# EAGLE design CAN_node_rpm_nof2v (EAGLE 7.2.0)
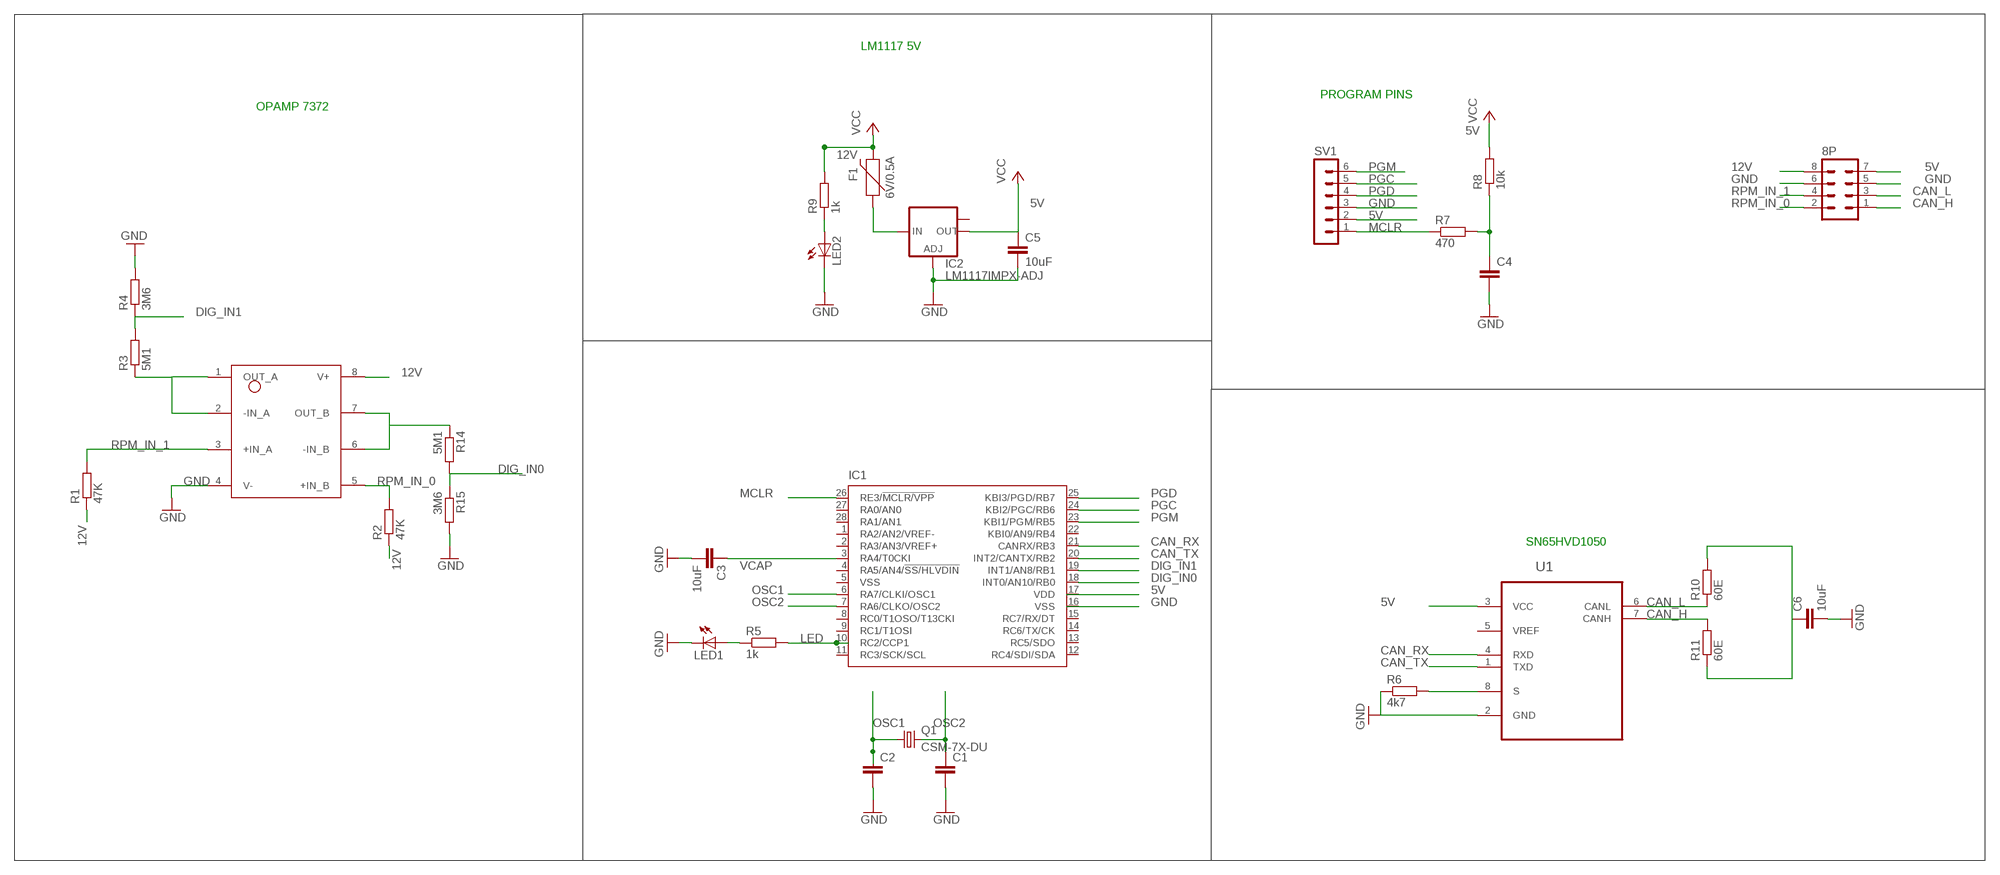
[diagram p0: schematic, sheet 1]

## Parts
8P  MA04-2  [MA04-2]
C1  C-EUC0805  [C0805]
C2  C-EUC0805  [C0805]
C3  10uF  C-EUC0805  [C0805]
C4  C-EUC0805  [C0805]
C5  10uF  C-EUC0805  [C0805]
C6  10uF  C-EUC0805  [C0805]
F1  6V/0.5A  PPTC_HALF-AMP  [1206]
IC1  MICROCHIP_PIC18F2580-I/ML  [MICROCHIP_QFN28-ML_6X6MM]
IC2  LM1117IMPX-ADJ  [SOT223]
LED1  LED_LEDCHIPLED_1206  [LED_CHIPLED_1206]
LED2  LED_LEDCHIPLED_1206  [LED_CHIPLED_1206]
LM1  7372  [7372]
Q1  CSM-7X-DU  [CSM-7X-DU]
R1  47K  R-EU_R0805  [R0805]
R2  47K  R-EU_R0805  [R0805]
R3  5M1  R-EU_R0805  [R0805]
R4  3M6  R-EU_R0805  [R0805]
R5  1k  R-EU_R0805  [R0805]
R6  4k7  R-EU_R0805  [R0805]
R7  470  R-EU_R0805  [R0805]
R8  10k  R-EU_R0805  [R0805]
R9  1k  R-EU_R0805  [R0805]
R10  60E  R-EU_R0805  [R0805]
R11  60E  R-EU_R0805  [R0805]
R14  5M1  R-EU_R0805  [R0805]
R15  3M6  R-EU_R0805  [R0805]
SV1  MA06-1  [MA06-1]
U1  TEXAS-INSTRUMENTS_BY_ELEMENT14_BATCH_1_SN65HVD1050D  [TEXAS-INSTRUMENTS_BY_ELEMENT14_BATCH_1_SOIC127P600X175-8N]

## Nets
5V: 8P.7 C5.1 IC1.17(VDD) IC2.2(OUT) R8.2 SV1.2 U1.3(VCC) ; supply symbol labelled VCC
12V: 8P.8 F1.2 LM1.8(V+) R1.1 R2.1 R9.2 ; supply symbol labelled VCC
CAN_H: 8P.1 R11.2 U1.7(CANH)
CAN_L: 8P.3 R10.1 U1.6(CANL)
CAN_RX: IC1.21(CANRX/RB3) U1.4(RXD)
CAN_TX: IC1.20(INT2/CANTX/RB2) U1.1(TXD)
DIG_IN0: IC1.18(INT0/AN10/RB0) R14.2 R15.1
DIG_IN1: IC1.19(INT1/AN8/RB1) R3.2 R4.1
GND: 8P.5 8P.6 C1.2 C2.2 C3.2 C4.2 C5.2 C6.2 IC1.16(VSS) IC2.1(ADJ) LED1.C LED2.C LM1.4(V-) R4.2 R6.1 R15.2 SV1.3 U1.2(GND)
LED: IC1.10(RC2/CCP1) R5.2
MCLR: IC1.26(RE3/!MCLR/VPP) R7.1 SV1.1
N$1: LED1.A R5.1
N$2: R6.2 U1.8(S)
N$3: C4.1 R7.2 R8.1
N$4: F1.1 IC2.3(IN)
N$5: LED2.A R9.1
N$7: C6.1 R10.2 R11.1
N$8: LM1.1(OUT_A) LM1.2(-IN_A) R3.1
N$10: LM1.6(-IN_B) LM1.7(OUT_B) R14.1
OSC1: C2.1 IC1.6(RA7/CLKI/OSC1) Q1.1
OSC2: C1.1 IC1.7(RA6/CLKO/OSC2) Q1.2
PGC: IC1.24(KBI2/PGC/RB6) SV1.5
PGD: IC1.25(KBI3/PGD/RB7) SV1.4
PGM: IC1.23(KBI1/PGM/RB5) SV1.6
RPM_IN_0: 8P.2 LM1.5(+IN_B) R2.2
RPM_IN_1: 8P.4 LM1.3(+IN_A) R1.2
VCAP: C3.1 IC1.3(RA4/T0CKI)
Unconnected: IC1.1(RA2/AN2/VREF-) IC1.2(RA3/AN3/VREF+) IC1.4(RA5/AN4/!SS/HLVDIN) IC1.8(RC0/T1OSO/T13CKI) IC1.9(RC1/T1OSI) IC1.11(RC3/SCK/SCL) IC1.12(RC4/SDI/SDA) IC1.13(RC5/SDO) IC1.14(RC6/TX/CK) IC1.15(RC7/RX/DT) IC1.22(KBI0/AN9/RB4) IC1.27(RA0/AN0) IC1.28(RA1/AN1) IC2.TAB(OUT1) U1.5(VREF)

## Notes on the sheet
- LM1117 5V
- PROGRAM PINS
- OPAMP 7372
- SN65HVD1050

## Power pins joined to a net without a drawn wire
VSS: IC1.5(VSS)

## Library data of the parts
8P = con-lstb:MA04-2: PIN HEADER; OC_FARNELL: unknown; OC_NEWARK: unknown
C1 C2 C4 C5 = rcl:C-EU: CAPACITOR, European symbol
C3 C6 = resistor:C-EU: CAPACITOR, European symbol
F1 = sparkfun_fuses:PPTC: Resettable Fuse PPTC Resettable Fuse. Really a sort of resistor with a polymeric positive temperature coefficient whose resistance increases dramatically with an increase in temperature. When heated by the power passing through the resistance rises causing the current to be limited, protecting the circuit. This is achieved by the transition of the polymer from a crystalline to an amorphous state where the conductive carbon separates breaking the conductive pathways found in the cool crystalline structure. When a PPTC cools back down it resumes conducting letting the circuit turn back on. SparkFun Products: SparkFun RedBoard - Programmed with Arduino <https://www.sparkfun.com/products/12757> Pro Micro - 5V/16MHz <https://www.sparkfun.com/products/12640> Arduino Pro 328 - 5V/16MHz <https://www.sparkfun.com/products/10915> MP3 Trigger <https://www.sparkfun.com/products/13720>; PROD_ID: RES-08585
IC1 = IITBRacing_CAN_node_Evo5:MICROCHIP_PIC18F2*80: 28-Pin Enhanced Flash Microcontrollers with ECAN(TM) Technology 10-Bit A/D and nanoWatt Technology Source: http://www.microchip.com .. 39637a.pdf; MF: MICROCHIP; MPN: PIC18F2580-I/ML; OC_FARNELL: 1556180; OC_NEWARK: 71J7242
IC2 = lm1117:LM1117IMPX-ADJ
LED1 LED2 = IITBRacing_CAN_node_Evo5:LED_LED: LED OSRAM: - CHIPLED LG R971, LG N971, LY N971, LG Q971, LY Q971, LO R971, LY R971 LH N974, LH R974 LS Q976, LO Q976, LY Q976 LO Q996 - Hyper CHIPLED LW Q18S LB Q993, LB Q99A, LB R99A - SideLED LS A670, LO A670, LY A670, LG A670, LP A670 LB A673, LV A673, LT A673, LW A673 LH A674 LY A675 LS A676, LA A676, LO A676, LY A676, LW A676 LS A679, LY A679, LG A679 - Hyper Micro SIDELED® LS Y876, LA Y876, LO Y876, LY Y876 LT Y87S - SmartLED LW L88C, LW L88S LB L89C, LB L89S, LG L890 LS L89K, LO L89K, LY L89K LS L896, LA L896, LO L896, LY L896 - TOPLED LS T670, LO T670, LY T670, LG T670, LP T670 LSG T670, LSP T670, LSY T670, LOP T670, LYG T670 LG T671, LOG T671, LSG T671 LB T673, LV T673, LT T673, LW T673 LH T674 LS T676, LA T676, LO T676, LY T676, LB T676, LH T676, LSB T676, LW T676 LB T67C, LV T67C, LT T67C, LS T67K, LO T67K, LY T67K, LW E67C LS E67B, LA E67B, LO E67B, LY E67B, LB E67C, LV E67C, LT E67C LW T67C LS T679, LY T679, LG T679 LS T770, LO T770, LY T770, LG T770, LP T770 LB T773, LV T773, LT T773, LW T773 LH T774 LS E675, LA E675, LY E675, LS T675 LS T776, LA T776, LO T776, LY T776, LB T776 LHGB T686 LT T68C, LB T68C - Hyper Mini TOPLED® LB M676 - Mini TOPLED Santana® LG M470 LS M47K, LO M47K, LY M47K Source: http://www.osram.convergy.de LUXEON: - LUMILED® LXK2-PW12-R00, LXK2-PW12-S00, LXK2-PW14-U00, LXK2-PW14-V00 LXK2-PM12-R00, LXK2-PM12-S00, LXK2-PM14-U00 LXK2-PE12-Q00, LXK2-PE12-R00, LXK2-PE12-S00, LXK2-PE14-T00, LXK2-PE14-U00 LXK2-PB12-K00, LXK2-PB12-L00, LXK2-PB12-M00, LXK2-PB14-N00, LXK2-PB14-P00, LXK2-PB14-Q00 LXK2-PR12-L00, LXK2-PR12-M00, LXK2-PR14-Q00, LXK2-PR14-R00 LXK2-PD12-Q00, LXK2-PD12-R00, LXK2-PD12-S00 LXK2-PH12-R00, LXK2-PH12-S00 LXK2-PL12-P00, LXK2-PL12-Q00, LXK2-PL12-R00 Source: www.luxeon.com KINGBRIGHT: KA-3528ASYC Source: www.kingbright.com
LM1 = 7372:7372
Q1 = crystal:CSM-7X-DU: SMD CRYSTAL Source: www.ecsxtal.com .. Crystal 3.6864MHz CSM_7X_DU.PDF; OC_FARNELL: unknown; OC_NEWARK: unknown
R1-R11 R14 R15 = resistor:R-EU_: RESISTOR, European symbol
SV1 = con-lstb:MA06-1: PIN HEADER; OC_FARNELL: unknown; OC_NEWARK: unknown
U1 = IITBRacing_CAN_node_Evo5:TEXAS-INSTRUMENTS_BY_ELEMENT14_BATCH_1_SN65HVD1050D: EMC OPTIMIZED CAN TRANSCEIVER; MPN: SN65HVD1050D; OC_FARNELL: 1220984; OC_NEWARK: 70K4439; PACKAGE: SOIC-8; SUPPLIER: Texas Instruments

## Board
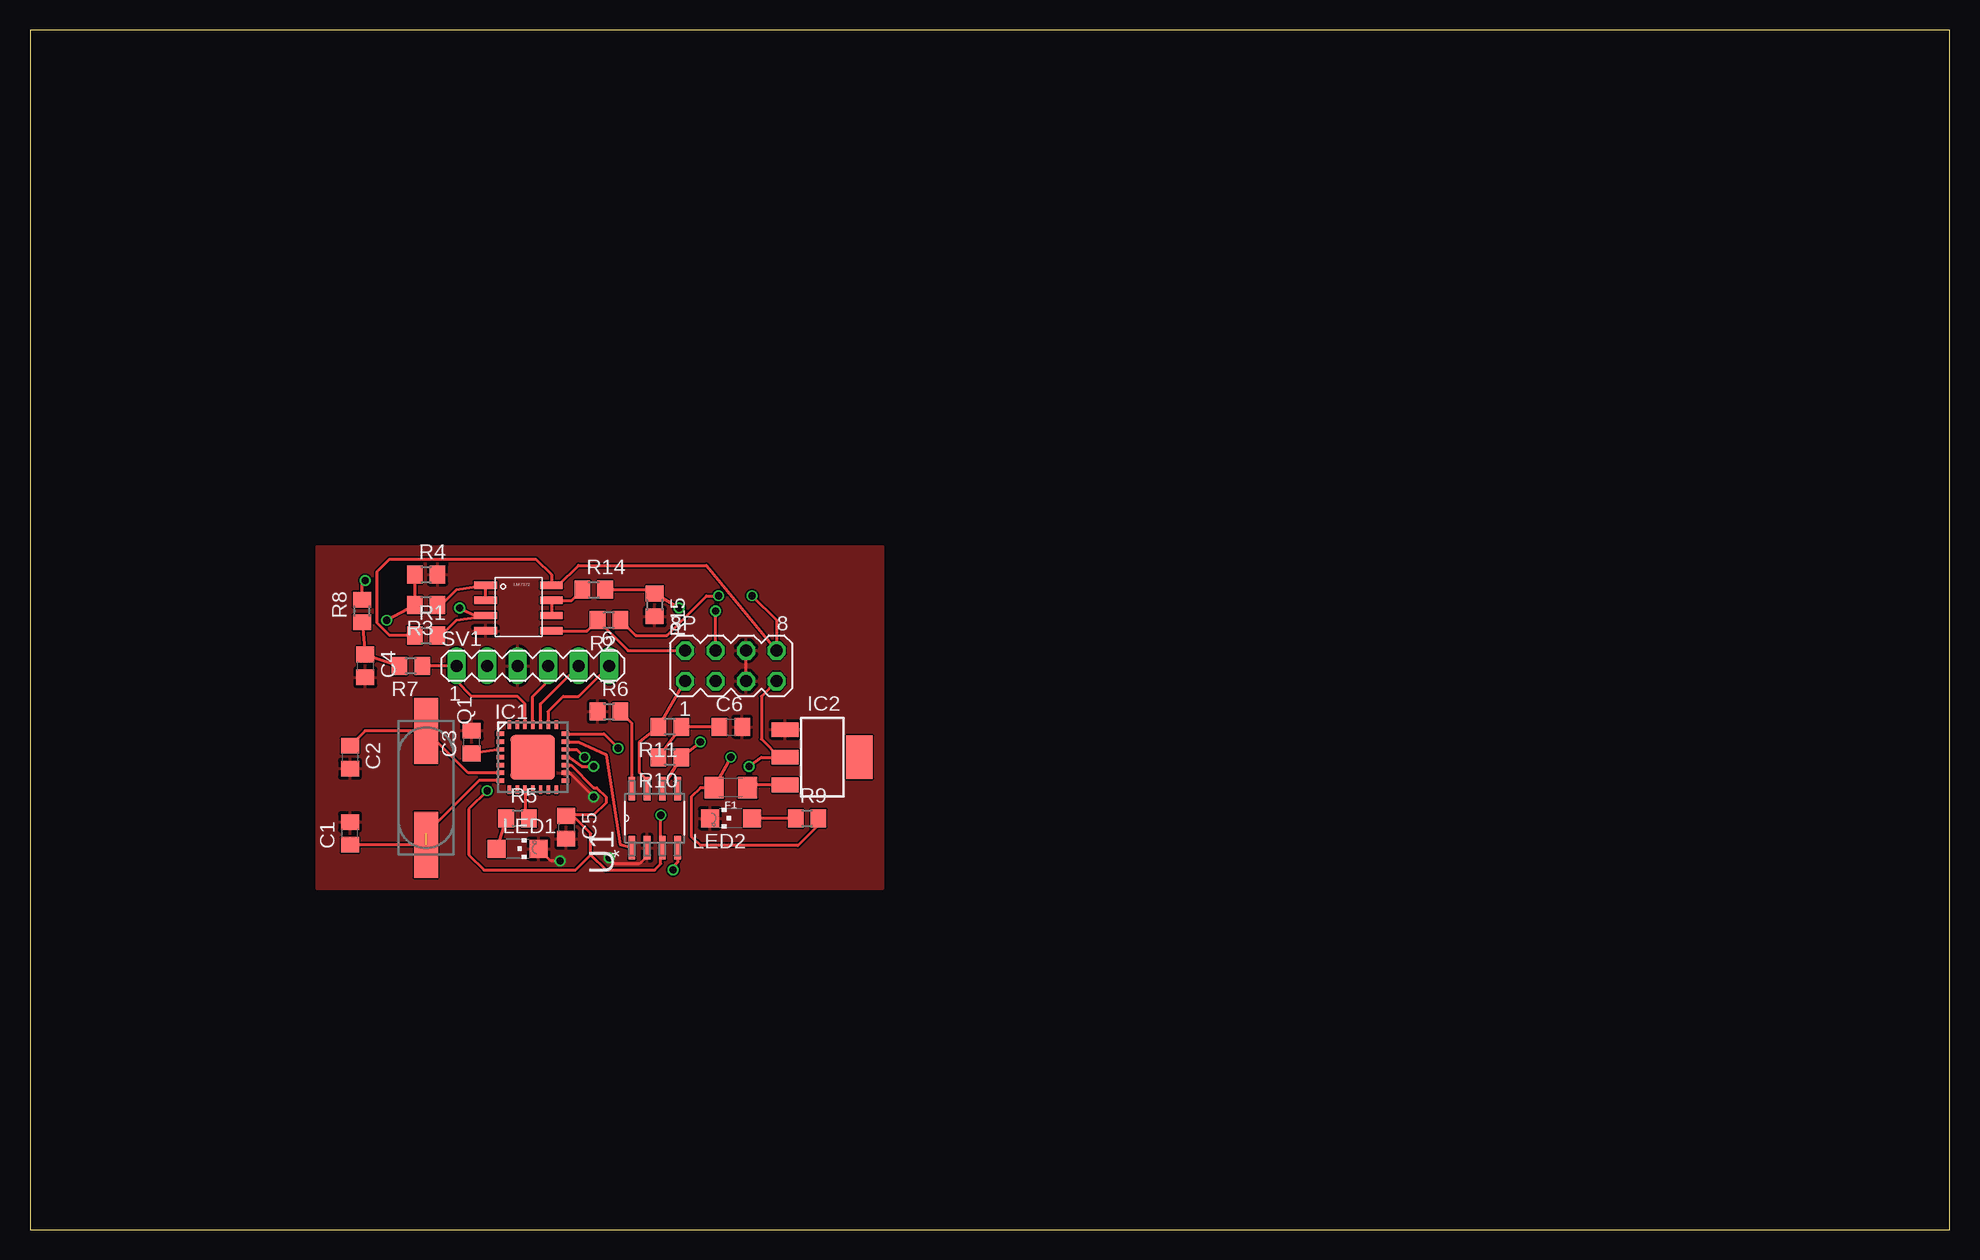
[diagram p1: board, top side]
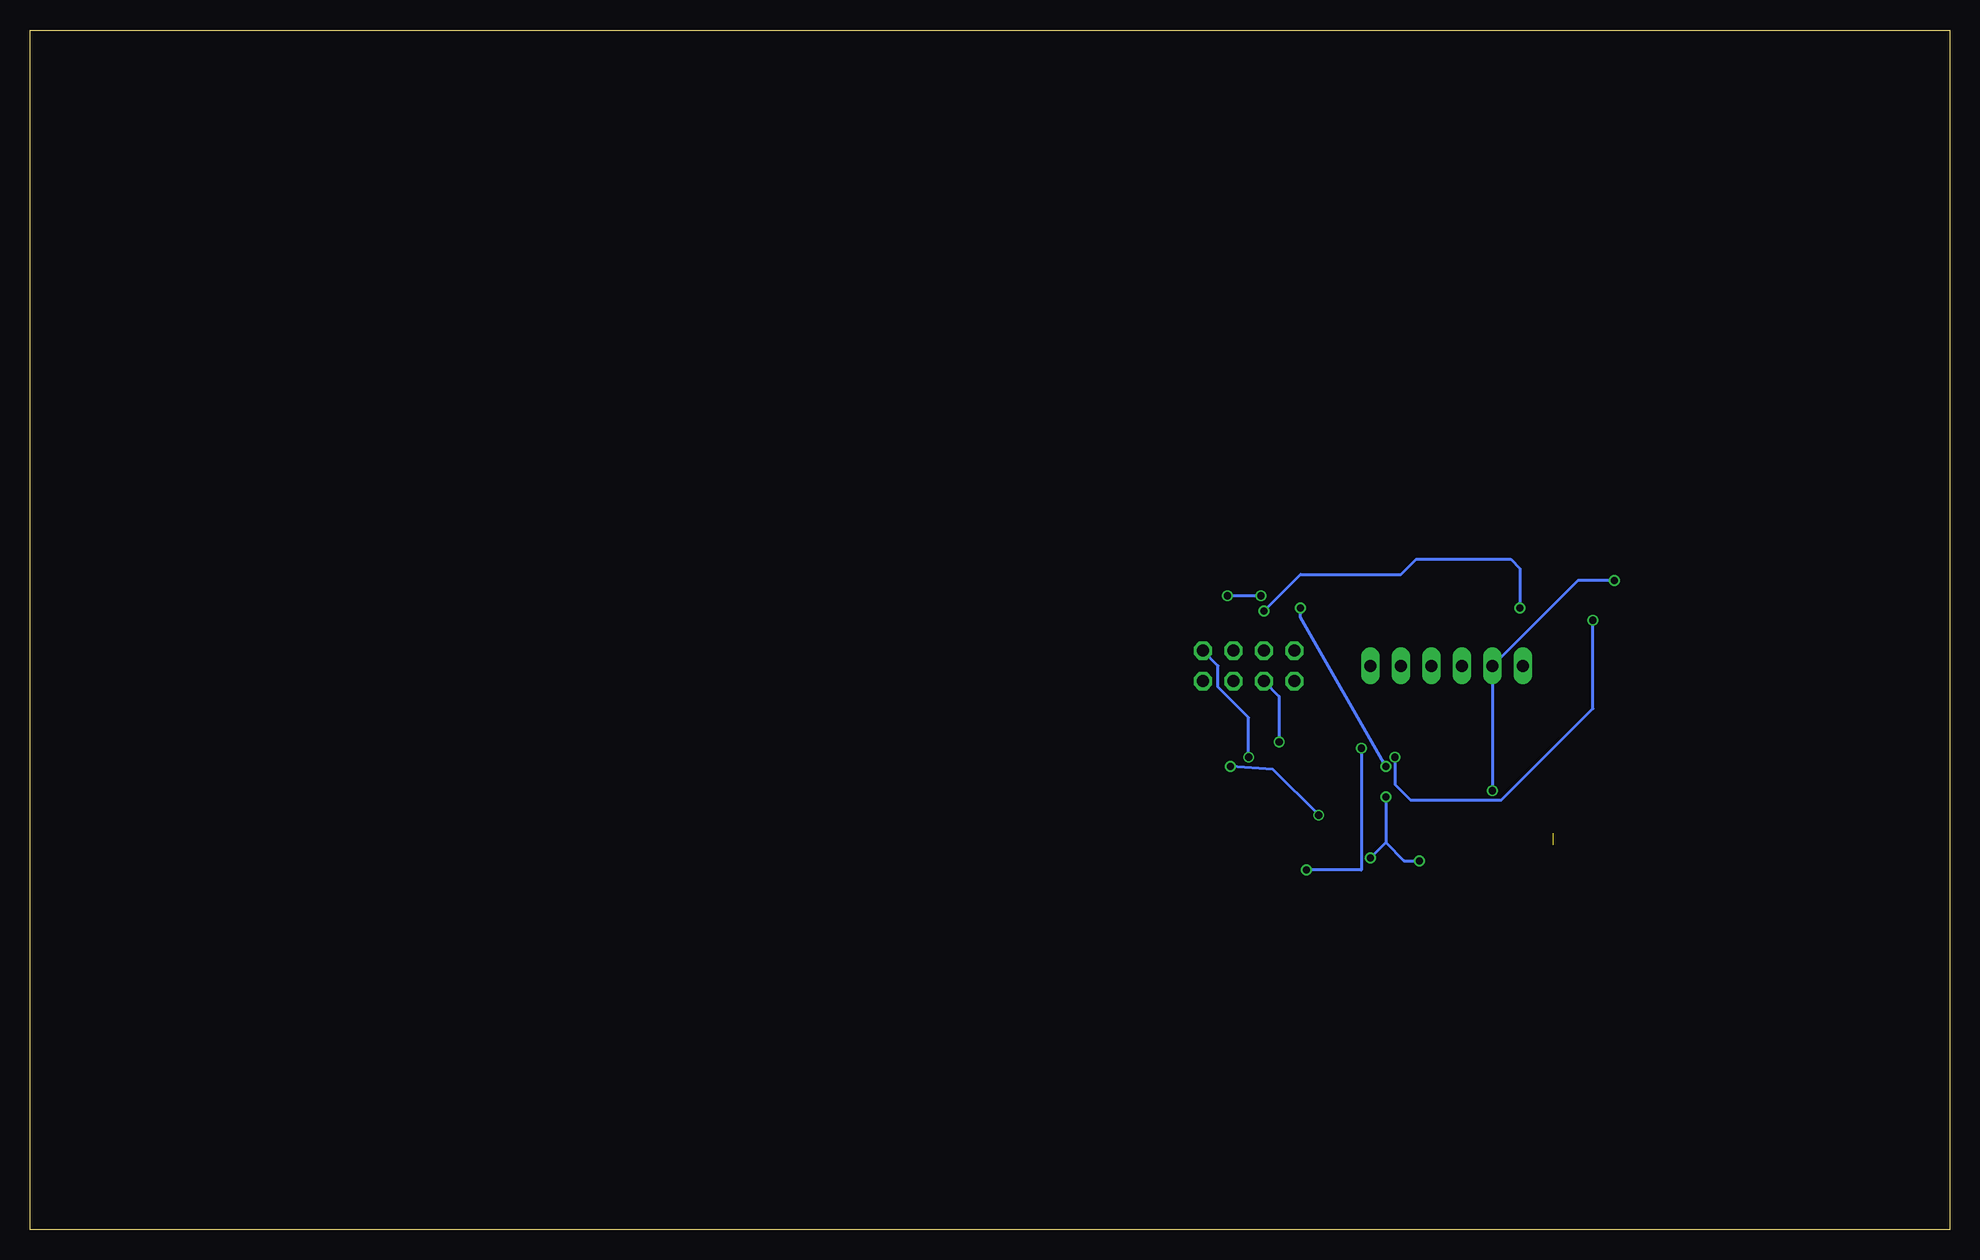
[diagram p2: board, bottom side, seen from below]

Size 160 x 100 mm. Coordinates in mm from the lower left corner, seen from the top.
Outline: 0,0 160,0 160,100 0,100 0,0
Copper layers (1*16): Top 0.035mm / dielectric 1.5mm / Bottom 0.035mm
Design rules "PCB_Power": minimum track width 5mil, minimum drill 10mil, track to track 5mil, track to pad 5mil, pad to pad 5mil, via to via 5mil, smd to smd 5mil, copper to edge 10mil, drill to drill 6mil, minimum pad ring 5mil, minimum via ring 5mil, stop-mask expansion 3mil, vias tented up to drill 0mil, thermal gap 10mil

### Footprints (pad centres in the part's own frame; a part is rotated, then mirrored left to right if it is on the bottom)
MA04-2 = drill 1.016 octagon: 1 -3.81,-1.27; 2 -3.81,1.27; 3 -1.27,-1.27; 4 -1.27,1.27; 5 1.27,-1.27; 6 1.27,1.27; 7 3.81,-1.27; 8 3.81,1.27
C0805 = smd 1.3 x 1.5: 1 -0.95,0; 2 0.95,0
1206 = smd 1.6 x 1.8: 1 -1.4,0; 2 1.4,0
MICROCHIP_QFN28-ML_6X6MM = smd 0.7 x 0.35: 1 -2.7,1.95; 2 -2.7,1.3; 3 -2.7,0.65; 4 -2.7,0; 5 -2.7,-0.65; 6 -2.7,-1.3; 7 -2.7,-1.95; 15 2.7,-1.95; 16 2.7,-1.3; 17 2.7,-0.65; 18 2.7,0; 19 2.7,0.65; 20 2.7,1.3; 21 2.7,1.95 | smd 0.35 x 0.7: 8 -1.95,-2.7; 9 -1.3,-2.7; 10 -0.65,-2.7; 11 0,-2.7; 12 0.65,-2.7; 13 1.3,-2.7; 14 1.95,-2.7; 22 1.95,2.7; 23 1.3,2.7; 24 0.65,2.7; 25 0,2.7; 26 -0.65,2.7; 27 -1.3,2.7; 28 -1.95,2.7 | smd 3.7 x 3.7: EXP 0,0
SOT223 = smd 1.219 x 2.235: 1 -2.311,-3.099; 2 0,-3.099; 3 2.311,-3.099 | smd 3.6 x 2.2: TAB 0,3.099
LED_CHIPLED_1206 = smd 1.5 x 1.5: A 0,-1.75; C 0,1.75
7372 = smd 0.61 x 1.905: 1 4.699,2.921; 2 5.969,2.921; 3 7.239,2.921; 4 8.509,2.921; 5 8.509,8.407; 6 7.239,8.407; 7 5.969,8.407; 8 4.699,8.407
CSM-7X-DU = smd 5.5 x 2: 1 -4.75,0; 2 4.75,0
R0805 = smd 1.3 x 1.5: 1 -0.95,0; 2 0.95,0
MA06-1 = drill 1.016 long: 1 -6.35,0; 2 -3.81,0; 3 -1.27,0; 4 1.27,0; 5 3.81,0; 6 6.35,0
TEXAS-INSTRUMENTS_BY_ELEMENT14_BATCH_1_SOIC127P600X175-8N = smd 1.981 x 0.559: 1 -2.464,1.905; 2 -2.464,0.635; 3 -2.464,-0.635; 4 -2.464,-1.905; 5 2.464,-1.905; 6 2.464,-0.635; 7 2.464,0.635; 8 2.464,1.905

### Placement (x,y rotation side)
8P  58.42,46.99 0 top
C1  26.67,33.02 90 top
C2  26.67,39.37 270 top
C3  36.83,40.64 90 top
C4  27.94,46.99 270 top
C5  44.7,33.53 270 top
C6  58.42,41.91 0 top
F1  58.42,36.83 180 top
IC1  41.91,39.37 0 top
IC2  66.04,39.37 270 top
LED1  40.64,31.75 270 top
LED2  58.42,34.29 90 top
LM1  35.05,58.42 270 top
Q1  33.02,36.83 270 top
R1  33.02,49.53 0 top
R2  48.26,50.8 180 top
R3  33.02,52.07 180 top
R4  33.02,54.61 0 top
R5  40.64,34.29 0 top
R6  48.26,43.18 0 top
R7  31.75,46.99 180 top
R8  27.69,51.56 90 top
R9  64.77,34.29 0 top
R10  53.34,39.37 180 top
R11  53.34,41.91 180 top
R14  46.99,53.34 0 top
R15  52.07,52.07 270 top
SV1  41.91,46.99 0 top
U1  52.07,34.29 90 top

### Tracks (layer width: path | path; a pad name or v marks a point on that pad's centre or on a via)
5V  (via drill 0.6)
  Top 0.254: R8.2 27.69,53.85 v27.94,54.1 | v38.1,36.58 36.58,35.05 36.58,31.24 37.85,29.97 45.47,29.97 46.74,31.24 | 46.74,31.24 46.74,33.02 45.28,34.48 45.21,34.48 | 45.21,34.48 C5.1 | 46.74,31.24 48.01,29.97 52.07,29.97 52.58,30.48 52.58,31.7 U1.3 | 52.7,31.11 U1.3 | 8P.7 60.96,44.45 60.96,40.89 62.48,39.37 IC2.2 60.96,39.37 v59.94,38.61 | U1.3 52.58,31.95 v52.58,34.54 | IC1.17 45.1,38.72 46.99,36.83 47.24,36.83 48.01,36.07 48.01,35.56 46.99,34.54 45.28,34.54 45.21,34.48
  Bottom 0.254: v27.94,54.1 30.99,54.1 SV1.2 v38.1,36.58 | v52.58,34.54 56.39,38.35 v59.94,38.61
12V  (via drill 0.6)
  Top 0.254: R1.1 29.97,49.53 28.96,50.55 28.96,54.86 29.97,55.88 42.16,55.88 43.46,54.59 LM1.8 44.07,53.72 45.72,55.37 56.39,55.37 8P.8 62.23,50.8 v60.2,52.83 | R2.1 50.48,49.53 53.09,49.53 56.39,52.83 v57.4,52.83 | v58.42,39.37 F1.2 55.88,36.83 55.12,36.07 55.12,32.77 55.88,32 64.01,32 65.72,33.72 R9.2
  Bottom 0.254: v57.4,52.83 v60.2,52.83 | v58.42,39.37 58.42,42.67 60.96,45.21 60.96,46.99 8P.8
CAN_H
  Top 0.254: U1.7 51.44,37.47 50.8,38.1 50.8,40.64 R11.2 8P.1
CAN_L  (via drill 0.6)
  Top 0.254: v55.88,40.64 R10.1 U1.6
  Bottom 0.254: 8P.3 55.88,44.45 v55.88,40.64
CAN_RX  (via drill 0.6)
  Top 0.254: IC1.21 47.83,41.32 v49.02,40.13 | v53.59,29.97 53.85,30.48 53.98,30.61 U1.4
  Bottom 0.254: v49.02,40.13 49.02,29.97 v53.59,29.97
CAN_TX
  Top 0.254: IC1.20 44.64,40.64 45.72,40.64 48.01,39.62 49.2,32.08 U1.1
DIG_IN0  (via drill 0.6)
  Top 0.254: R14.2 51.75,53.34 R15.1 v54.1,51.82 | v46.99,38.61 45.97,38.61 44.96,39.37 IC1.18
  Bottom 0.254: v46.99,38.61 54.1,51.05 v54.1,51.82
DIG_IN1  (via drill 0.6)
  Top 0.254: R4.1 R3.2 v29.72,50.8 | v46.23,39.37 45.58,40.02 IC1.19
  Bottom 0.254: v29.72,50.8 29.72,43.43 37.34,35.81 44.96,35.81 46.23,37.08 v46.23,39.37
GND  (via drill 0.6)
  Top 0.254: 8P.5 8P.6 | IC1.16 44.99,38.07 v46.99,36.07 | v44.2,30.73 43.41,30.73 LED1.C | U1.2 51.44,31.11 50.8,30.48 48.77,30.48 v48.26,30.99
  Bottom 0.254: v46.99,36.07 46.99,32.26 | 46.99,32.26 45.47,30.73 v44.2,30.73 | v48.26,30.99 46.99,32.26
  pour Top: 23.88,28.45 71.12,28.45 71.12,56.9 23.88,56.9
LED
  Top 0.254: IC1.10 41.26,34.62 R5.2
MCLR
  Top 0.254: IC1.26 41.26,43.83 40.64,44.45 36.83,44.45 35.56,45.72 SV1.1 R7.1
N$1
  Top 0.254: R5.1 LED1.A
N$2
  Top 0.254: R6.2 50.16,42.23 U1.8
N$3
  Top 0.254: R8.1 C4.1 R7.2
N$4
  Top 0.254: IC2.3 60.05,37.06 F1.1
N$5
  Top 0.254: R9.1 LED2.A
N$7
  Top 0.254: C6.1 R11.1 R10.2
N$8
  Top 0.254: LM1.2 LM1.1 35.56,53.34 34.29,52.07 R3.1
N$10
  Top 0.254: LM1.6 LM1.7 45.15,52.45 R14.1
OSC1
  Top 0.254: IC1.6 36.53,38.07 Q1.1 27.93,41.58 C2.1
OSC2  (1 unrouted)
  Top 0.254: IC1.7 37.42,37.42 33.02,33.02 | Q1.2 C1.1
PGC
  Top 0.254: IC1.24 42.56,43.83 SV1.5
PGD
  Top 0.254: IC1.25 41.91,44.45 43.18,45.72 SV1.4
PGM
  Top 0.254: IC1.23 43.21,43.15 43.18,43.18 44.45,44.45 45.72,44.45 SV1.6
RPM_IN_0
  Top 0.254: LM1.5 46.42,49.91 R2.2 49.85,48.26 8P.2
RPM_IN_1  (via drill 0.6)
  Top 0.254: R1.2 34.29,49.53 35.56,50.8 37.33,51.08 | 37.33,51.08 LM1.3 | 8P.4 v57.15,51.56 | v35.81,51.82 37.33,51.08
  Bottom 0.254: v57.15,51.56 54.1,54.61 45.72,54.61 44.45,55.88 36.58,55.88 35.81,55.12 v35.81,51.82
VCAP
  Top 0.254: IC1.3 C3.1